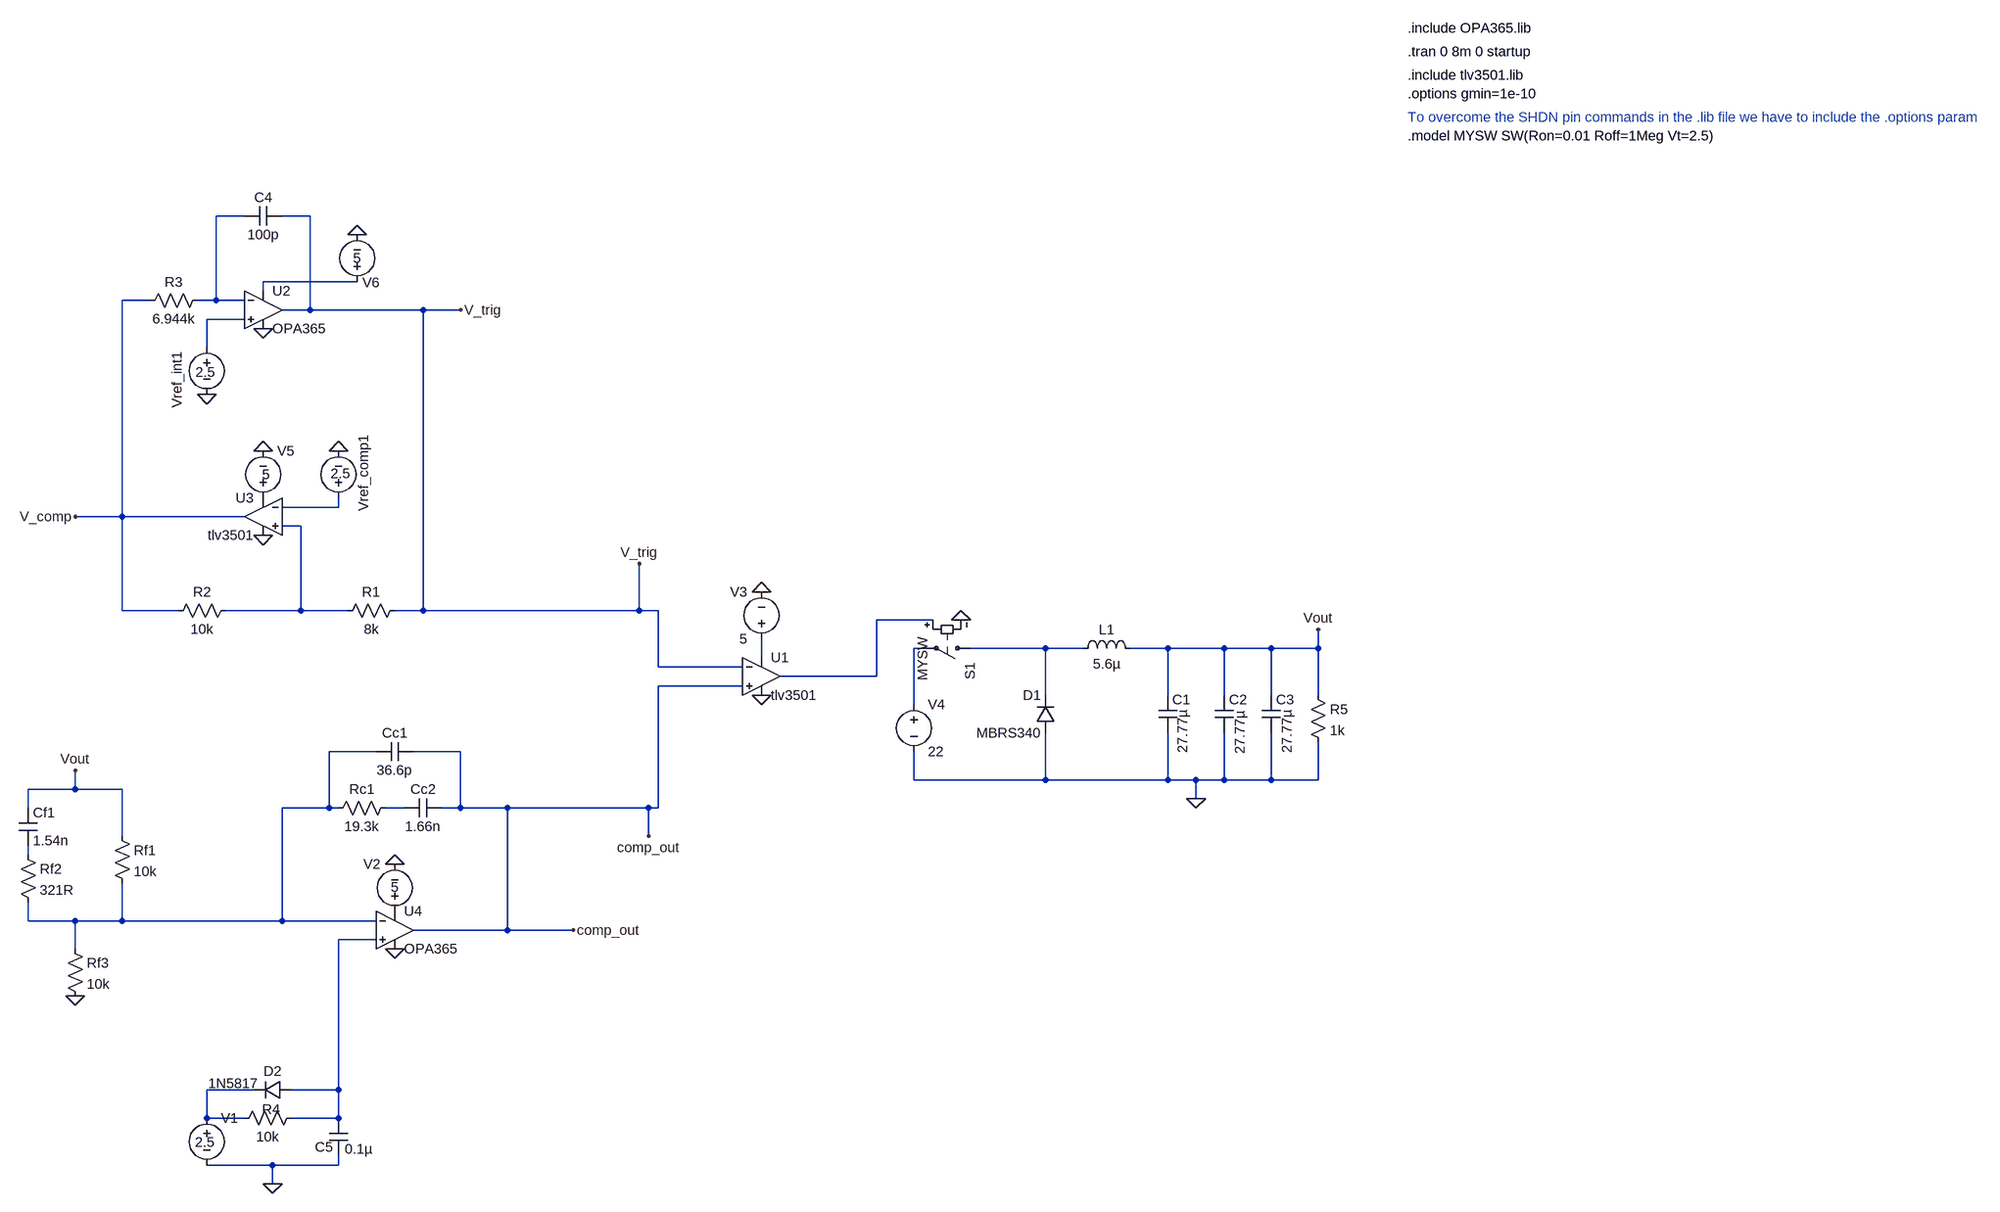
[diagram p0: schematic Draft1.asc]
Draft1.asc, the LTspice schematic file:
Version 4.1
SHEET 1 2580 1124
WIRE -784 -560 -832 -560
WIRE -672 -560 -720 -560
WIRE -592 -448 -752 -448
WIRE -752 -432 -752 -448
WIRE -944 -416 -992 -416
WIRE -832 -416 -832 -560
WIRE -832 -416 -864 -416
WIRE -784 -416 -832 -416
WIRE -672 -400 -672 -560
WIRE -672 -400 -720 -400
WIRE -480 -400 -672 -400
WIRE -416 -400 -480 -400
WIRE -784 -384 -848 -384
WIRE -848 -336 -848 -384
WIRE -624 -64 -624 -80
WIRE -624 -64 -720 -64
WIRE -992 -48 -992 -416
WIRE -992 -48 -1072 -48
WIRE -784 -48 -992 -48
WIRE -688 -32 -720 -32
WIRE -992 112 -992 -48
WIRE -896 112 -992 112
WIRE -688 112 -688 -32
WIRE -688 112 -816 112
WIRE -608 112 -688 112
WIRE -480 112 -480 -400
WIRE -480 112 -528 112
WIRE -112 112 -112 32
WIRE -112 112 -480 112
WIRE -80 112 -112 112
WIRE 416 128 320 128
WIRE 400 176 384 176
WIRE 608 176 480 176
WIRE 672 176 608 176
WIRE 816 176 752 176
WIRE 912 176 816 176
WIRE 992 176 912 176
WIRE 1072 176 1072 144
WIRE 1072 176 992 176
WIRE 96 192 96 160
WIRE -80 208 -80 112
WIRE 64 208 -80 208
WIRE 320 224 320 128
WIRE 320 224 128 224
WIRE 64 240 -80 240
WIRE 608 256 608 176
WIRE 816 256 816 176
WIRE 912 256 912 176
WIRE 992 256 992 176
WIRE 1072 256 1072 176
WIRE 384 272 384 176
WIRE -560 352 -640 352
WIRE -416 352 -496 352
WIRE 384 400 384 352
WIRE 608 400 608 320
WIRE 608 400 384 400
WIRE 816 400 816 320
WIRE 816 400 608 400
WIRE 864 400 816 400
WIRE 912 400 912 320
WIRE 912 400 864 400
WIRE 992 400 992 320
WIRE 992 400 912 400
WIRE 1072 400 1072 336
WIRE 1072 400 992 400
WIRE -1072 416 -1072 384
WIRE -1072 416 -1152 416
WIRE -992 416 -1072 416
WIRE 864 432 864 400
WIRE -1152 448 -1152 416
WIRE -640 448 -640 352
WIRE -640 448 -720 448
WIRE -624 448 -640 448
WIRE -512 448 -544 448
WIRE -416 448 -416 352
WIRE -416 448 -448 448
WIRE -336 448 -416 448
WIRE -96 448 -336 448
WIRE -80 448 -80 240
WIRE -80 448 -96 448
WIRE -992 496 -992 416
WIRE -96 496 -96 448
WIRE -1152 528 -1152 512
WIRE -1152 640 -1152 608
WIRE -1072 640 -1152 640
WIRE -992 640 -992 576
WIRE -992 640 -1072 640
WIRE -720 640 -720 448
WIRE -720 640 -992 640
WIRE -560 640 -720 640
WIRE -336 656 -336 448
WIRE -336 656 -496 656
WIRE -224 656 -336 656
WIRE -560 672 -624 672
WIRE -1072 688 -1072 640
WIRE -768 928 -848 928
WIRE -624 928 -624 672
WIRE -624 928 -704 928
WIRE -848 976 -848 928
WIRE -784 976 -848 976
WIRE -624 976 -624 928
WIRE -624 976 -704 976
WIRE -736 1056 -848 1056
WIRE -624 1056 -624 1040
WIRE -624 1056 -736 1056
WIRE -736 1088 -736 1056
FLAG 864 432 0
FLAG -1072 768 0
FLAG -528 544 0
FLAG -528 688 0
FLAG -224 656 comp_out
FLAG 1072 144 Vout
FLAG 96 256 0
FLAG -96 496 comp_out
FLAG 96 80 0
FLAG 464 128 0
FLAG -752 -160 0
FLAG -592 -528 0
FLAG -752 -16 0
FLAG -624 -160 0
FLAG -848 -256 0
FLAG -416 -400 V_trig
FLAG -1072 -48 V_comp
FLAG -752 -368 0
FLAG -112 32 V_trig
FLAG -1072 384 Vout
FLAG -736 1088 0
SYMBOL cap 800 256 R0
WINDOW 3 42 24 VRight 2
SYMATTR Value 27.77µ
SYMATTR InstName C1
SYMATTR SpiceLine V=25 Rser=2.94m Lser=0.6n
SYMBOL ind 656 192 R270
WINDOW 0 32 56 VTop 2
WINDOW 3 5 56 VBottom 2
SYMATTR InstName L1
SYMATTR Value 5.6µ
SYMATTR SpiceLine Rser=1m
SYMBOL voltage -848 960 R0
WINDOW 123 0 0 Left 0
WINDOW 39 0 0 Left 0
WINDOW 3 -20 57 Left 2
SYMATTR Value 2.5
SYMATTR InstName V1
SYMBOL res -1008 480 R0
SYMATTR InstName Rf1
SYMATTR Value 10k
SYMBOL res -1168 512 R0
SYMATTR InstName Rf2
SYMATTR Value 321R
SYMBOL cap -1168 448 R0
SYMATTR InstName Cf1
SYMATTR Value 1.54n
SYMBOL res -528 432 R90
WINDOW 0 0 56 VBottom 2
WINDOW 3 32 56 VTop 2
SYMATTR InstName Rc1
SYMATTR Value 19.3k
SYMBOL cap -496 336 R90
WINDOW 0 0 32 VBottom 2
WINDOW 3 32 32 VTop 2
SYMATTR InstName Cc1
SYMATTR Value 36.6p
SYMBOL res -1088 672 R0
SYMATTR InstName Rf3
SYMATTR Value 10k
SYMBOL voltage -528 640 R180
WINDOW 0 24 96 Left 2
WINDOW 3 -7 57 Left 2
WINDOW 123 0 0 Left 0
WINDOW 39 0 0 Left 0
SYMATTR InstName V2
SYMATTR Value 5
SYMBOL cap -448 432 R90
WINDOW 0 0 32 VBottom 2
WINDOW 3 32 32 VTop 2
SYMATTR InstName Cc2
SYMATTR Value 1.66n
SYMBOL cap 896 256 R0
WINDOW 3 43 26 VRight 2
SYMATTR Value 27.77µ
SYMATTR InstName C2
SYMATTR SpiceLine V=25 Rser=2.94m Lser=0.6n
SYMBOL cap 976 256 R0
WINDOW 3 43 24 VRight 2
SYMATTR Value 27.77µ
SYMATTR InstName C3
SYMATTR SpiceLine V=25 Rser=2.94m Lser=0.6n
SYMBOL OpAmps\\opamp2 96 160 R0
SYMATTR InstName U1
SYMATTR Value tlv3501
SYMBOL voltage 96 176 R180
WINDOW 0 24 96 Left 2
WINDOW 3 24 16 Left 2
WINDOW 123 0 0 Left 0
WINDOW 39 0 0 Left 0
SYMATTR InstName V3
SYMATTR Value 5
SYMBOL sw 496 176 R90
WINDOW 3 -19 97 Left 2
SYMATTR Value MYSW
SYMATTR InstName S1
SYMBOL diode 624 320 R180
WINDOW 0 24 64 Left 2
WINDOW 3 24 0 Left 2
SYMATTR InstName D1
SYMATTR Value MBRS340
SYMBOL voltage 384 256 R0
WINDOW 123 0 0 Left 0
WINDOW 39 0 0 Left 0
SYMATTR InstName V4
SYMATTR Value 22
SYMBOL voltage -752 -64 M180
WINDOW 0 24 96 Left 2
WINDOW 3 -2 56 Left 2
WINDOW 123 0 0 Left 0
WINDOW 39 0 0 Left 0
SYMATTR InstName V5
SYMATTR Value 5
SYMBOL voltage -592 -432 R180
WINDOW 0 -38 14 Left 2
WINDOW 3 -7 56 Left 2
WINDOW 123 0 0 Left 0
WINDOW 39 0 0 Left 0
SYMATTR InstName V6
SYMATTR Value 5
SYMBOL res -512 96 R90
WINDOW 0 0 56 VBottom 2
WINDOW 3 32 56 VTop 2
SYMATTR InstName R1
SYMATTR Value 8k
SYMBOL res -800 96 R90
WINDOW 0 0 56 VBottom 2
WINDOW 3 32 56 VTop 2
SYMATTR InstName R2
SYMATTR Value 10k
SYMBOL res -848 -432 R90
WINDOW 0 0 56 VBottom 2
WINDOW 3 32 56 VTop 2
SYMATTR InstName R3
SYMATTR Value 6.944k
SYMBOL cap -720 -576 R90
WINDOW 0 0 32 VBottom 2
WINDOW 3 32 32 VTop 2
SYMATTR InstName C4
SYMATTR Value 100p
SYMBOL voltage -624 -64 R180
WINDOW 0 -43 -7 VRight 2
WINDOW 3 -21 57 Left 2
WINDOW 123 0 0 Left 0
WINDOW 39 0 0 Left 0
SYMATTR InstName Vref_comp1
SYMATTR Value 2.5
SYMBOL voltage -848 -352 R0
WINDOW 0 -50 22 VRight 2
WINDOW 3 -19 58 Left 2
WINDOW 123 0 0 Left 0
WINDOW 39 0 0 Left 0
SYMATTR InstName Vref_int1
SYMATTR Value 2.5
SYMBOL OpAmps\\opamp2 -752 -464 R0
SYMATTR InstName U2
SYMATTR Value OPA365
SYMBOL OpAmps\\opamp2 -752 -112 M0
SYMATTR InstName U3
SYMATTR Value tlv3501
SYMBOL OpAmps\\opamp2 -528 592 R0
SYMATTR InstName U4
SYMATTR Value OPA365
SYMBOL res -688 960 R90
WINDOW 0 17 50 VBottom 2
WINDOW 3 32 56 VTop 2
SYMATTR InstName R4
SYMATTR Value 10k
SYMBOL cap -640 976 R0
WINDOW 0 -24 49 Left 2
WINDOW 3 27 53 Left 2
SYMATTR InstName C5
SYMATTR Value 0.1µ
SYMBOL diode -704 912 R90
WINDOW 0 0 32 VBottom 2
WINDOW 3 -11 99 VTop 2
SYMATTR InstName D2
SYMATTR Value 1N5817
SYMBOL res 1056 240 R0
SYMATTR InstName R5
SYMATTR Value 1k
TEXT 1528 -696 Left 2 !.model MYSW SW(Ron=0.01 Roff=1Meg Vt=2.5)
TEXT 1528 -880 Left 2 !.include OPA365.lib
TEXT 1528 -800 Left 2 !.include tlv3501.lib
TEXT 1528 -840 Left 2 !.tran 0 8m 0 startup
TEXT 1528 -768 Left 2 !.options gmin=1e-10
TEXT 1528 -728 Left 2 ;To overcome the SHDN pin commands in the .lib file we have to include the .options param

The netlist it stands for:
* Draft1.asc
C1 Vout 0 27.77µ V=25 Rser=2.94m Lser=0.6n
L1 N008 Vout 5.6µ Rser=1m
V1 N014 0 2.5
Rf1 Vout N010 10k
Rf2 N012 N010 321R
Cf1 Vout N012 1.54n
Rc1 N011 N010 19.3k
Cc1 comp_out N010 36.6p
Rf3 N010 0 10k
V2 P001 0 5
Cc2 comp_out N011 1.66n
C2 Vout 0 27.77µ V=25 Rser=2.94m Lser=0.6n
C3 Vout 0 27.77µ V=25 Rser=2.94m Lser=0.6n
X§U1 comp_out V_trig N009 0 N006 tlv3501  ; pins In+ In- V+ V- OUT
V3 N009 0 5
S1 N008 N007 N006 0 MYSW
D1 0 N008 MBRS340
V4 N007 0 22
V5 P002 0 5
V6 N002 0 5
R1 V_trig N005 8k
R2 N005 V_comp 10k
R3 N001 V_comp 6.944k
C4 V_trig N001 100p
Vref_comp1 N004 0 2.5
Vref_int1 N003 0 2.5
X§U2 N003 N001 N002 0 V_trig OPA365  ; pins In+ In- V+ V- OUT
X§U3 N005 N004 P002 0 V_comp tlv3501  ; pins In+ In- V+ V- OUT
X§U4 N013 N010 P001 0 comp_out OPA365  ; pins In+ In- V+ V- OUT
R4 N013 N014 10k
C5 N013 0 0.1µ
D2 N013 N014 1N5817
R5 Vout 0 1k
.model D D
.lib standard.dio
.model MYSW SW(Ron=0.01 Roff=1Meg Vt=2.5)
.include OPA365.lib
.include tlv3501.lib
.tran 0 8m 0 startup
.options gmin=1e-10
* To overcome the SHDN pin commands in the .lib file we have to include the .options param
.backanno
.end